# Altium schematic sheet Snickerdoodle PS.SchDoc: Snickerdoodle PS
size Tabloid; ApprovedBy: NA; CompanyName: Cospan Design LLC; DrawnBy: Dave McCoy; Engineer: Dave McCoy; DocumentNumber: 3; Revision: A; SheetNumber: 3; SheetTotal: 20; Client: Public; Project: Enigma; ProjectPrettyName: Enigma
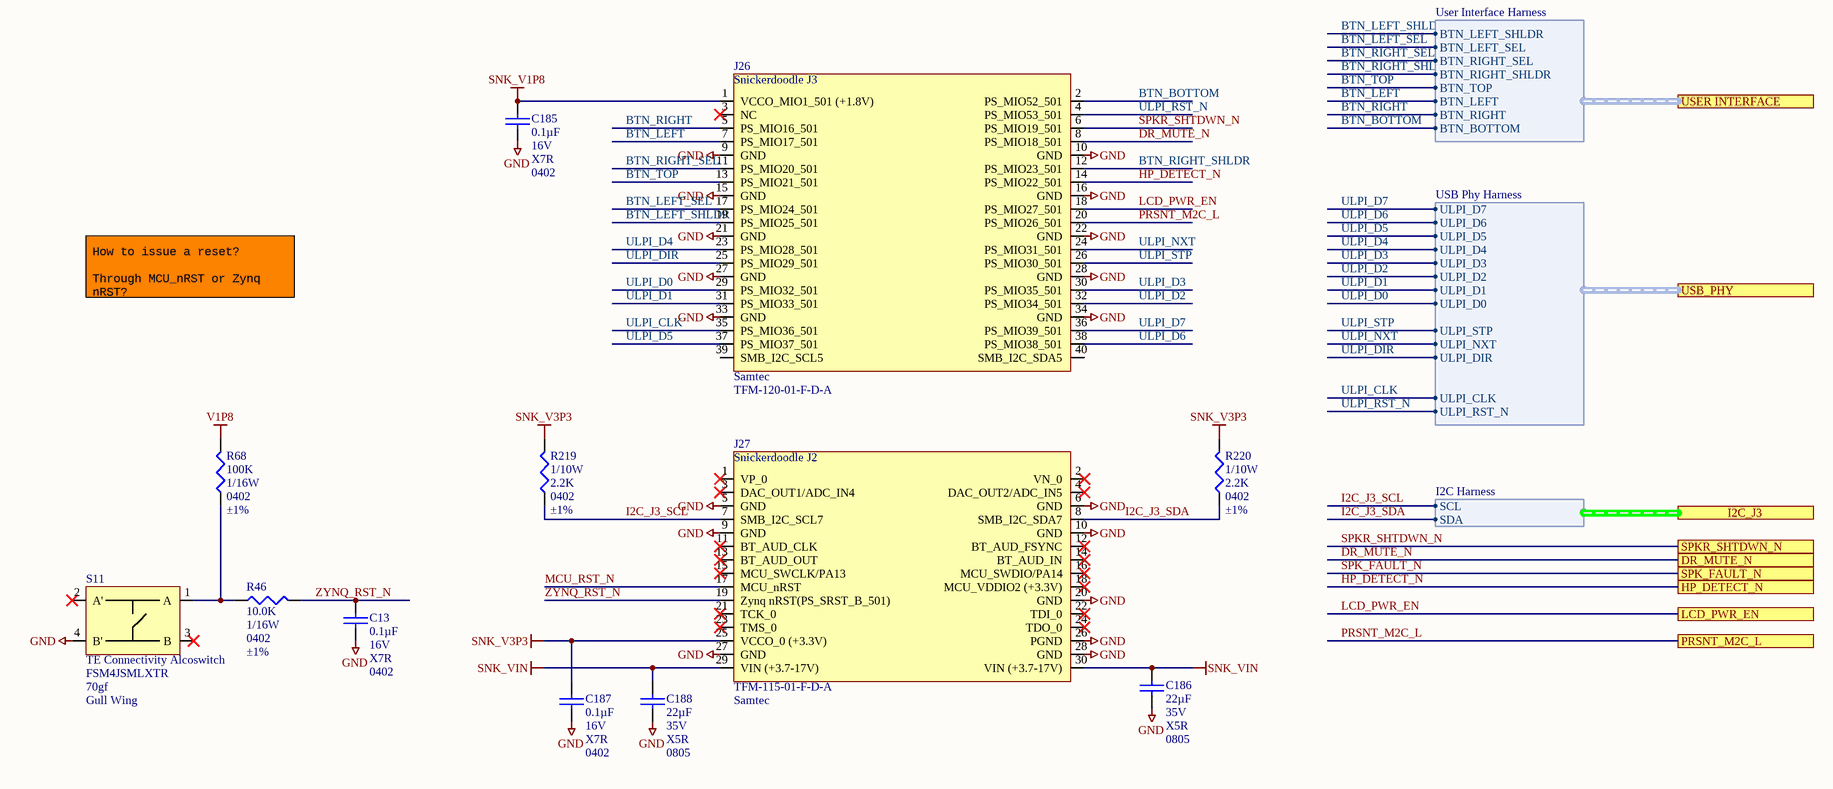
[diagram p0: Snickerdoodle PS.SchDoc]

## Parts
C13  Capacitance: 0.1µF  Voltage - Rated: 16V  Temperature Coefficient: X7R  Package / Case: 0402  [C_0402]  (hidden comment: 0.1uF)
C185  Capacitance: 0.1µF  Voltage - Rated: 16V  Temperature Coefficient: X7R  Package / Case: 0402  [C_0402]  (hidden comment: 0.1uF)
C186  Capacitance: 22µF  Voltage - Rated: 35V  Temperature Coefficient: X5R  Package / Case: 0805  [C_ERA-0805]  (hidden comment: C_0805_22µF_35V)
C187  Capacitance: 0.1µF  Voltage - Rated: 16V  Temperature Coefficient: X7R  Package / Case: 0402  [C_0402]  (hidden comment: 0.1uF)
C188  Capacitance: 22µF  Voltage - Rated: 35V  Temperature Coefficient: X5R  Package / Case: 0805  [C_ERA-0805]  (hidden comment: C_0805_22µF_35V)
J26  Manufacturer: Samtec  Manufacturer Part Number: TFM-120-01-F-D-A  [TFM12001-X-D-A]  (hidden comment: J_SNICKERDOODLE_J3)
J27  Manufacturer Part Number: TFM-115-01-F-D-A  Manufacturer: Samtec  [TFM11501-X-D-A]  (hidden comment: J_SNICKERDOODLE_J2)
R46  Resistance In Ohms: 10.0K  Power (Watts): 1/16W  Case: 0402  Tolerance: ±1%  [R_0402]  (hidden comment: R_0402_10.0K)
R68  Resistance In Ohms: 100K  Power (Watts): 1/16W  Case: 0402  Tolerance: ±1%  [R_0402]  (hidden comment: R_0402_100K)
R219  Power (Watts): 1/10W  Resistance In Ohms: 2.2K  Case: 0402  Tolerance: ±1%  [R_0402]  (hidden comment: 2.2k Ohms)
R220  Power (Watts): 1/10W  Resistance In Ohms: 2.2K  Case: 0402  Tolerance: ±1%  [R_0402]  (hidden comment: 2.2k Ohms)
S11  Manufacturer: TE Connectivity Alcoswitch  Manufacturer Part Number: FSM4JSMLXTR  Operating Force: 70gf  Termination: Gull Wing  [TACTILE_1571563_2]  (hidden comment: S_TACTILE_1571563_2_BUTTON)

## Ports
DR_MUTE_N, HP_DETECT_N, I2C_J3 (harness I2C Harness), LCD_PWR_EN, PRSNT_M2C_L, SPK_FAULT_N, SPKR_SHTDWN_N, USB_PHY (harness USB Phy Harness), USER INTERFACE (harness User Interface Harness)

## Harnesses
User Interface Harness: BTN_LEFT_SHLDR, BTN_LEFT_SEL, BTN_RIGHT_SEL, BTN_TOP, BTN_LEFT, BTN_RIGHT, BTN_BOTTOM, BTN_RIGHT_SHLDR
USB Phy Harness: ULPI_D7, ULPI_D6, ULPI_D5, ULPI_D4, ULPI_D3, ULPI_D2, ULPI_D1, ULPI_D0, ULPI_STP, ULPI_NXT, ULPI_DIR, ULPI_CLK, ULPI_RST_N
I2C Harness: SCL, SDA

## Nets
GND: C13.1 C185.1 C186.1 C187.1 C188.1 J26.9(GND) J26.10(GND) J26.15(GND) J26.16(GND) J26.21(GND) J26.22(GND) J26.27(GND) J26.28(GND) J26.33(GND) J26.34(GND) J27.5(GND) J27.6(GND) J27.9(GND) J27.10(GND) J27.20(GND) J27.26(PGND) J27.27(GND) J27.28(GND) S11.4(B')
SNK_V1P8: C185.2 J26.1(VCCO_MIO1_501_(+1.8V))
SNK_V3P3: C187.2 J27.25(VCCO_0_(+3.3V)) R219.1 R220.1
SNK_VIN: C186.2 C188.2 J27.29(VIN_(+3.7-17V)) J27.30(VIN_(+3.7-17V))
V1P8: R68.1
BTN_BOTTOM: J26.2(PS_MIO52_501) ; port USER INTERFACE.BTN_BOTTOM
BTN_LEFT: J26.7(PS_MIO17_501) ; port USER INTERFACE.BTN_LEFT
BTN_LEFT_SEL: J26.17(PS_MIO24_501) ; port USER INTERFACE.BTN_LEFT_SEL
BTN_LEFT_SHLDR: J26.19(PS_MIO25_501) ; port USER INTERFACE.BTN_LEFT_SHLDR
BTN_RIGHT: J26.5(PS_MIO16_501) ; port USER INTERFACE.BTN_RIGHT
BTN_RIGHT_SEL: J26.11(PS_MIO20_501) ; port USER INTERFACE.BTN_RIGHT_SEL
BTN_RIGHT_SHLDR: J26.12(PS_MIO23_501) ; port USER INTERFACE.BTN_RIGHT_SHLDR
BTN_TOP: J26.13(PS_MIO21_501) ; port USER INTERFACE.BTN_TOP
DR_MUTE_N: J26.8(PS_MIO18_501) ; port DR_MUTE_N
HP_DETECT_N: J26.14(PS_MIO22_501) ; port HP_DETECT_N
I2C_J3_SCL: J27.7(SMB_I2C_SCL7) R219.2 ; port I2C_J3.SCL
I2C_J3_SDA: J27.8(SMB_I2C_SDA7) R220.2 ; port I2C_J3.SDA
LCD_PWR_EN: J26.18(PS_MIO27_501) ; port LCD_PWR_EN
MCU_RST_N: J27.17(MCU_nRST)
PRSNT_M2C_L: J26.20(PS_MIO26_501) ; port PRSNT_M2C_L
SPK_FAULT_N: port SPK_FAULT_N
SPKR_SHTDWN_N: J26.6(PS_MIO19_501) ; port SPKR_SHTDWN_N
ULPI_CLK: J26.35(PS_MIO36_501) ; port USB_PHY.ULPI_CLK
ULPI_D0: J26.29(PS_MIO32_501) ; port USB_PHY.ULPI_D0
ULPI_D1: J26.31(PS_MIO33_501) ; port USB_PHY.ULPI_D1
ULPI_D2: J26.32(PS_MIO34_501) ; port USB_PHY.ULPI_D2
ULPI_D3: J26.30(PS_MIO35_501) ; port USB_PHY.ULPI_D3
ULPI_D4: J26.23(PS_MIO28_501) ; port USB_PHY.ULPI_D4
ULPI_D5: J26.37(PS_MIO37_501) ; port USB_PHY.ULPI_D5
ULPI_D6: J26.38(PS_MIO38_501) ; port USB_PHY.ULPI_D6
ULPI_D7: J26.36(PS_MIO39_501) ; port USB_PHY.ULPI_D7
ULPI_DIR: J26.25(PS_MIO29_501) ; port USB_PHY.ULPI_DIR
ULPI_NXT: J26.24(PS_MIO31_501) ; port USB_PHY.ULPI_NXT
ULPI_RST_N: J26.4(PS_MIO53_501) ; port USB_PHY.ULPI_RST_N
ULPI_STP: J26.26(PS_MIO30_501) ; port USB_PHY.ULPI_STP
ZYNQ_RST_N: C13.2 J27.19(Zynq_nRST(PS_SRST_B_501)) R46.1
NetR46_2: R46.2 R68.2 S11.1(A)

Not connected (* = marked no-connect by the designer): J26 3(NC)* 39(SMB_I2C_SCL5) 40(SMB_I2C_SDA5); J27 1(VP_0)* 2(VN_0)* 3(DAC_OUT1/ADC_IN4)* 4(DAC_OUT2/ADC_IN5)* 11(BT_AUD_CLK)* 12(BT_AUD_FSYNC)* 13(BT_AUD_OUT)* 14(BT_AUD_IN)* 15(MCU_SWCLK/PA13)* 16(MCU_SWDIO/PA14)* 18(MCU_VDDIO2_(+3.3V))* 21(TCK_0)* 22(TDI_0)* 23(TMS_0)* 24(TDO_0)*; S11 2(A')* 3(B)*

## Notes on the sheet
- How to issue a reset?
  Through MCU_nRST or Zynq nRST?
- Project:
- http://www.cospandesign.com
- Cospan Design
- Document:
- Engineer:
- Title:
- Client:
- Approved By:
- Revision:
- Date:
- Number:
- of
- (in symbol J_SNICKERDOODLE_J2) Snickerdoodle J2
- (in symbol J_SNICKERDOODLE_J3) Snickerdoodle J3

## Library data of the parts
C13 C185 C187 = C_0402_0.1UF_16V: CAP CER .10UF 16V X7R 0402; Manufacturer: Murata Electronics North America; Manufacturer Part Number: GRM155R71C104KA88J; Tolerance: ±10%; Supplier 1: Digi-Key; Supplier Part Number 1: 490-6328-1-ND; RoHS: RoHS Compliant; Category: Capacitors; Stock 1: 18103134; Mounting Type: Surface Mount, MLCC; Features: -; Lead Spacing: -; Packaging: Cut Tape (CT); ComponentLink1URL: http://www.murata.com/~/media/webrenewal/support/library/catalog/products/capacitor/mlcc/c02e.ashx?la=en-us; ComponentLink1Description: http://www.murata.com/~/media/webrenewal/support/library/catalog/products/capacitor/mlcc/c02e.ashx?la=en-us; Operating Temperature: -55°C ~ 125°C; Pricing 1: 1=0.1, 10=0.014, 100=0.0062, 500=0.00442, 1000=0.00348, 2500=0.00316, 5000=0.00291 (USD); Part Status: Active; Ratings: -; Applications: General Purpose; Size / Dimension: 0.039" L x 0.020" W (1.00mm x 0.50mm); Height - Seated (Max): -; Thickness (Max): 0.022" (0.55mm)
C186 C188 = C_0805_22µF_35V: CAP CER 22UF 35V X5R 0805; Manufacturer: TDK Corporation; Manufacturer Part Number: C2012X5R1V226M125AC; Tolerance: ±20%; Supplier 1: Digi-Key; RoHS: RoHS Compliant; Category: Capacitors; Stock 1: 3681; Pricing 1: 1=1.14, 10=0.863, 100=0.6176, 500=0.47818, 1000=0.41176 (USD); Packaging: Cut Tape (CT); Mounting Type: Surface Mount, MLCC; Operating Temperature: -55°C ~ 85°C; Applications: General Purpose; Ratings: -; Size / Dimension: 0.079" L x 0.049" W (2.00mm x 1.25mm); Height - Seated (Max): -; Thickness (Max): 0.057" (1.45mm); Lead Spacing: -; Features: Low ESL; Lead Style: -; ComponentLink1URL: https://product.tdk.com/info/en/catalog/datasheets/mlcc_commercial_general_en.pdf; ComponentLink1Description: https://product.tdk.com/info/en/catalog/datasheets/mlcc_commercial_general_en.pdf; Supplier Part Number 1: 445-14428-1-ND; Part Status: Active; Failure Rate: -
J26 = J_SNICKERDOODLE_J3: SNICKERDOODLE J3
J27 = J_SNICKERDOODLE_J2: SNICKERDOODLE J2
R46 = R_0402_10.0K: RES 10.0K OHM 1/16W 1% 0402 SMD; Manufacturer: Stackpole Electronics Inc; Manufacturer Part Number: RMCF0402FT10K0; Resistance (Ohms): 10k; Temperature Coefficient: ±100ppm/°C; Supplier 1: Digi-Key; Supplier Part Number 1: RMCF0402FT10K0CT-ND; RoHS: RoHS Compliant; Category: Resistors; Stock 1: 234525; Pricing: 1=0.04, 10=0.025, 50=0.0138, 100=0.0105, 250=0.0078, 500=0.00576, 1000=0.00384, 2500=0.00324, 5000=0.0027 (USD); Composition: Thick Film; Features: -; Package / Case: 0402 (1005 Metric); Size / Dimension: 0.039" L x 0.020" W (1.00mm x 0.50mm); Height: 0.016" (0.40mm); Number of Terminations: 2; Packaging: Cut Tape (CT); ComponentLink1URL: http://www.seielect.com/Catalog/SEI-RMCF_RMCP.pdf; ComponentLink1Description: http://www.seielect.com/Catalog/SEI-RMCF_RMCP.pdf
R68 = R_0402_100K: RES SMD 100K OHM 1% 1/16W 0402; Manufacturer: Yageo; Manufacturer Part Number: RC0402FR-07100KL; Temperature Coefficient: ±100ppm/°C; Supplier 1: Digi-Key; RoHS: RoHS Compliant; Category: Resistors; Stock 1: 4989982; Pricing 1: 1=0.1, 10=0.013, 25=0.0096, 100=0.0054, 250=0.00412, 500=0.00328, 1000=0.00242, 2500=0.0021, 5000=0.00173 (USD); Packaging: Cut Tape (CT); Resistance (Ohms): 100k; Composition: Thick Film; Features: Moisture Resistant; Operating Temperature: -55°C ~ 155°C; Package / Case: 0402 (1005 Metric); Supplier Device Package: 0402; Size / Dimension: 0.039" L x 0.020" W (1.00mm x 0.50mm); Height: 0.016" (0.40mm); Number of Terminations: 2; ComponentLink1URL: http://www.yageo.com/NewPortal/yageodocoutput?fileName=/pdf/R-Chip/PYu-RC_Group_51_RoHS_L_3.pdf; ComponentLink1Description: http://www.yageo.com/NewPortal/yageodocoutput?fileName=/pdf/R-Chip/PYu-RC_Group_51_RoHS_L_3.pdf; Supplier Part Number 1: 311-100KLRCT-ND
R219 R220 = R_0402_2.2K: RES 2.20K OHM 1/10W 1% 0402 SMD; Manufacturer: Yageo; Manufacturer Part Number: RC0402FR-072K2L; Temperature Coefficient: ±100ppm/°C; Supplier 1: Digi-Key; Supplier Part Number 1: 311-2.20KLRCT-ND; RoHS: RoHS Compliant; Category: Resistors; Stock 1: 0; Pricing: 10=0.014, 100=0.0063, 500=0.00382, 1000=0.0027, 5000=0.00203 (USD); Resistance (Ohms): 2.2K; Composition: Thick Film; Features: -; Package / Case: 0402 (1005 Metric); Size / Dimension: 0.039" L x 0.020" W (1.00mm x 0.50mm); Height: 0.016" (0.40mm); Number of Terminations: 2; Packaging: Cut Tape (CT); ComponentLink1URL: http://www.yageo.com/documents/recent/PYu-RC0402_51_RoHS_L_6.pdf; ComponentLink1Description: http://www.yageo.com/documents/recent/PYu-RC0402_51_RoHS_L_6.pdf; Supplier 2: Digi-Key; Supplier Part Number 2: RMCF0402FT2K20CT-ND; Stock 2: 39712; ComponentLink2URL: http://www.seielect.com/Catalog/SEI-RMCF_RMCP.pdf; ComponentLink2Description: http://www.seielect.com/Catalog/SEI-RMCF_RMCP.pdf
S11 = S_TACTILE_1571563_2_BUTTON: SWITCH TACTILE SPST-NO 0.05A 24V; Mechanical Life: 1000000Cycles; Actuator Material: Nylon,Polyamide; Illumination Type: Non-Illuminated; Throw Configuration: SPST; Switch Travel: 0.25mm; Supplier 1: Digikey; Stock 1: 4653; Pricing 1: 1=0.68, 10=0.655, 25=0.6428, 50=0.6184, 100=0.5335, 500=0.4607, 1000=0.3637, 1200=0.3066 (USD); Min Operating Temperature: -35°C; Max Operating Temperature: 85°C; Package Quantity: 4800; Packaging: Tape and Reel; Supplier Part Number 1: 450-2057-1-ND